# EAGLE schematic sound detect (EAGLE 7.5.0)
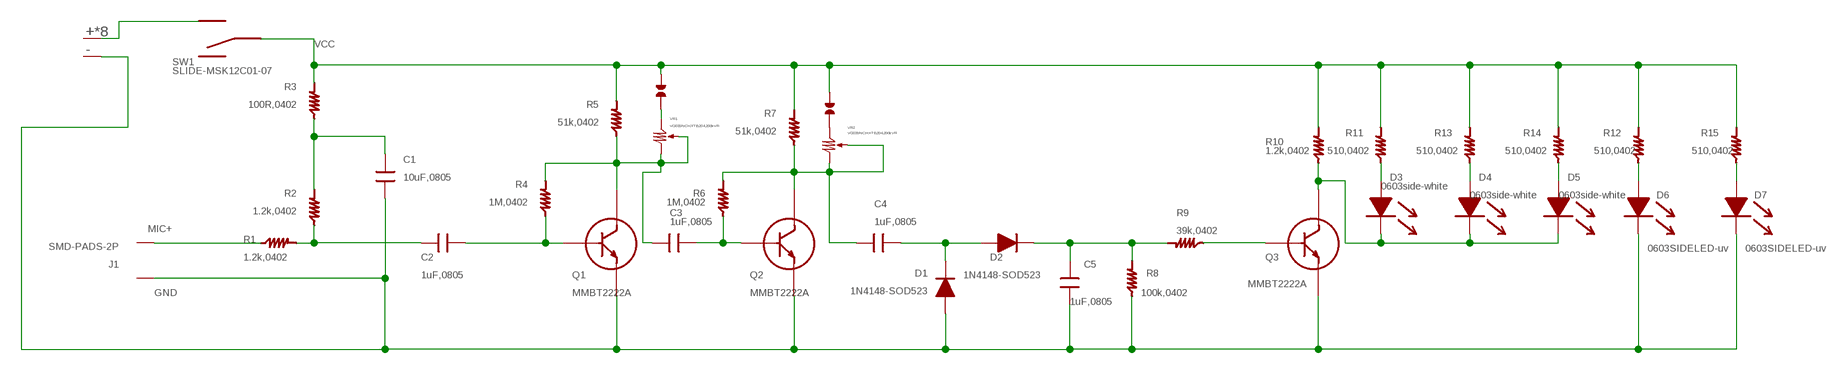
[diagram p0: schematic, sheet 1]

## Parts
C1  10uF,0805  CAP-0805  [CAP-0805C-LEVELB]
C2  1uF,0805  CAP-0805  [CAP-0805C-LEVELB]
C3  1uF,0805  CAP-0805  [CAP-0805C-LEVELB]
C4  1uF,0805  CAP-0805  [CAP-0805C-LEVELB]
C5  1uF,0805  CAP-0805  [CAP-0805C-LEVELB]
D1  1N4148-SOD523  [SOD523]
D2  1N4148-SOD523  [SOD523]
D3  0603side-white  0603SIDELED  [SMD-0603-LED-SIDE]
D4  0603side-white  0603SIDELED  [SMD-0603-LED-SIDE]
D5  0603side-white  0603SIDELED  [SMD-0603-LED-SIDE]
D6  0603SIDELED-uv  0603SIDELED  [SMD-0603-LED-SIDE]
D7  0603SIDELED-uv  0603SIDELED  [SMD-0603-LED-SIDE]
J1  SMD-PADS-2P  [SMD-2P-2.0]
J2  SHORT_PAD  [SHORTPAD]
J3  SHORT_PAD  [SHORTPAD]
J4  CR2032-THR  [CR2032-SMD]
Q1  MMBT2222A  [SOT23-3]
Q2  MMBT2222A  [SOT23-3]
Q3  MMBT2222A  [SOT23-3]
R1  1.2k,0402  RES-0402  [RES-0402R-REFLOW]
R2  1.2k,0402  RES-0402  [RES-0402R-REFLOW]
R3  100R,0402  RES-0402  [RES-0402R-REFLOW]
R4  1M,0402  RES-0402  [RES-0402R-REFLOW]
R5  51k,0402  RES-0402  [RES-0402R-REFLOW]
R6  1M,0402  RES-0402  [RES-0402R-REFLOW]
R7  51k,0402  RES-0402  [RES-0402R-REFLOW]
R8  100k,0402  RES-0402  [RES-0402R-REFLOW]
R9  39k,0402  RES-0402  [RES-0402R-REFLOW]
R10  1.2k,0402  RES-0402  [RES-0402R-REFLOW]
R11  510,0402  RES-0402  [RES-0402R-REFLOW]
R12  510,0402  RES-0402  [RES-0402R-REFLOW]
R13  510,0402  RES-0402  [RES-0402R-REFLOW]
R14  510,0402  RES-0402  [RES-0402R-REFLOW]
R15  510,0402  RES-0402  [RES-0402R-REFLOW]
SW1  SLIDE-MSK12C01-07  [SLIDE-SW-MSK-12C01-07]
VR1  VG039NCHXTB204,200kVR  VARIABLE_RES_SMD-3638  [SMD-3638]
VR2  VG039NCHXTB204,200kVR  VARIABLE_RES_SMD-3638  [SMD-3638]

## Nets
GND: C1.P$1 C5.P$2 D1.A D6.C(K) D7.C(K) J1.P$1 J4.- Q1.P$2(2-E) Q2.P$2(2-E) Q3.P$2(2-E) R8.P$1
MIC+: J1.P$2 R1.P$1
N$1: C2.P$2 R1.P$2 R2.P$1
N$2: C2.P$1 Q1.P$1(1-B) R4.P$1
N$3: C3.P$1 Q2.P$1(1-B) R6.P$1
N$4: C1.P$2 R2.P$2 R3.P$1
N$5: J4.+ J4.+1(+) J4.++1(+) J4.++(+) J4.P$1(+) J4.P$2(+) J4.P$3(+) J4.P$4(+) SW1.POS2(POS-2)
N$6: C4.P$1 D1.K D2.A
N$7: Q3.P$1(1-B) R9.P$1
N$8: C5.P$1 D2.K R8.P$2 R9.P$2
N$9: C4.P$2 Q2.P$3(3-C) R6.P$2 R7.P$1 VR2.P$1 VR2.P$2
N$10: D7.A R15.P$1
N$11: D3.C(K) D4.C(K) D5.C(K) Q3.P$3(3-C) R10.P$1
N$12: D3.A R11.P$1
N$13: D6.A R12.P$1
N$14: D4.A R13.P$1
N$15: J2.P$1 VR1.P$3
N$16: D5.A R14.P$1
N$17: C3.P$2 Q1.P$3(3-C) R4.P$2 R5.P$1 VR1.P$1 VR1.P$2
N$18: J3.P$1 VR2.P$3
VCC: J2.P$2 J3.P$2 R3.P$2 R5.P$2 R7.P$2 R10.P$2 R11.P$2 R12.P$2 R13.P$2 R14.P$2 R15.P$2 SW1.COM
Unconnected: SW1.POS1

## Library data of the parts
C1-C5 = hh-led-2019:CAP-0805
D1 D2 = hh-led-2019:1N4148-SOD523: 1n-4148 sod523
D3-D7 = hh-led-2019:0603SIDELED
J1 = hh-led-2019:SMD-PADS-2P
J2 J3 = hh-led-2019:SHORT_PAD
J4 = hh-led-2019:CR2032-THR
Q1-Q3 = hh-led-2019:MMBT2222A
R1-R15 = hh-led-2019:RES-0402
SW1 = hh-led-2019:SLIDE-MSK12C01-07
VR1 VR2 = hh-led-2019:VARIABLE_RES_SMD-3638